# Altium schematic sheet Lesegerät_Lastmodulation_Sekundär.SchDoc
size A4; SheetNumber: 5; SheetTotal: 6
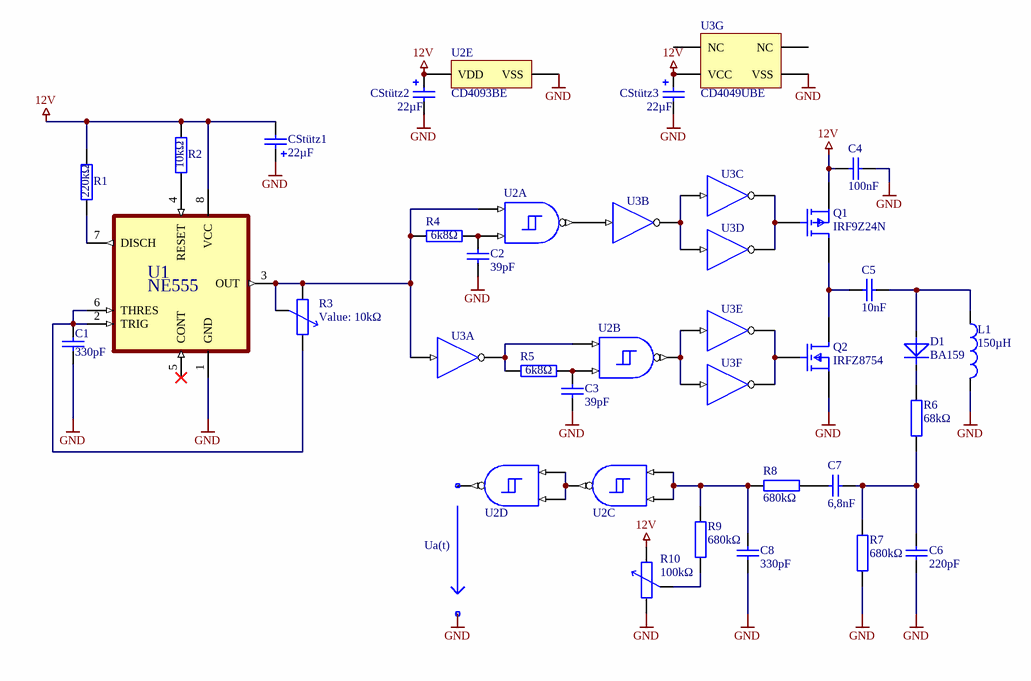
[diagram p0: Lesegerät_Lastmodulation_Sekundär.SchDoc]

## Parts
*  Ua(t)
C1  330pF  [rad-7.2/2.5/5]
C2  value 39pF  [rad-7.2/2.5/5]  (hidden comment: KO)
C3  value 39pF  [rad-7.2/2.5/5]  (hidden comment: KO)
C4  value 100nF  [rad-7.2/2.5/5]  (hidden comment: KO)
C5  value 10nF  [rad-7.2/2.5/5]  (hidden comment: KO)
C6  value 220pF  [rad-7.2/2.5/5]  (hidden comment: KO)
C7  value 6,8nF  [rad-7.2/2.5/5]  (hidden comment: KO)
C8  value 330pF  [rad-7.2/2.5/5]  (hidden comment: KO)
CStütz1  value 22µF  [RB-.1/.2]  (hidden comment: ELKO)
CStütz2  value 22µF  [RB-.1/.2]  (hidden comment: ELKO)
CStütz3  value 22µF  [RB-.1/.2]  (hidden comment: ELKO)
D1  BA159  [DIODE-0.6]
L1  value 150µH  (hidden comment: Inductor)
Q1  IRF9Z24N  [FP-PG-SOT323-3-IPC_A]
Q2  IRFZ8754  [FP-SOT23-IPC_A]
R1  value 220kΩ  [Axial-0.4]  (hidden comment: RES)
R2  value 10kΩ  [Axial-0.4]  (hidden comment: RES)
R3  value 10kΩ  [PT15]  (hidden comment: POT)
R4  value 6k8Ω  [Axial-0.4]  (hidden comment: RES)
R5  value 6k8Ω  [Axial-0.4]  (hidden comment: RES)
R6  value 68kΩ  [Axial-0.4]  (hidden comment: RES)
R7  value 680kΩ  [Axial-0.4]  (hidden comment: RES)
R8  value 680kΩ  [Axial-0.4]  (hidden comment: RES)
R9  value 680kΩ  [Axial-0.4]  (hidden comment: RES)
R10  value 100kΩ  [PT15]  (hidden comment: POT)
U1  NE555  [DIP794W45P254L959H508Q8]
U2  CD4093BE  [N0014A]  (value not drawn)  (parts A,B,C,D,E of 5)
U3  CD4049UBE  [N0016A]  (value not drawn)  (parts A,B,C,D,E,F,G of 7)

## Nets
12V: C4.1 CStütz1.2 CStütz2.1 CStütz3.1 Q1.2(S) R1.2 R2.2 R10.2 U1.8(VCC) U2.14(VDD) U3.1(VCC)
GND: C1.2 C2.2 C3.2 C4.2 C6.2 C8.2 CStütz1.1 CStütz2.2 CStütz3.2 L1.2 Q2.2(S) R7.1 R10.1 U1.1(GND) U2.7(VSS) U3.8(VSS)
NetC1_1: C1.1 R3.2 U1.2(TRIG) U1.6(THRES)
NetC2_1: C2.1 R4.2 U2.2(B)
NetC3_1: C3.1 R5.2 U2.6(D)
NetC5_1: C5.1 Q1.3(D) Q2.3(D)
NetC5_2: C5.2 D1.1(A) L1.1
NetC6_1: C6.1 C7.2 R6.1 R7.2
NetC7_1: C7.1 R8.1
NetC8_1: C8.1 R8.2 R9.1 U2.8(E) U2.9(F)
NetD1_2: D1.2(K) R6.2
NetQ1_G2: Q1.G2(G) U3.6(I=~{C}) U3.10(J=~{D})
NetQ2_G1: Q2.G1(G) U3.12(K=~{E}) U3.15(L=~{F})
NetR1_1: R1.1 U1.7(DISCH)
NetR2_1: R2.1 U1.4(RESET)
NetR3_1: R3.1 R3.3 R4.1 U1.3(OUT) U2.1(A) U3.3(A)
NetR5_1: R5.1 U2.5(C) U3.2(G=~{A})
NetR9_2: R9.2 R10.3
NetU2_3: U2.3(J) U3.5(B)
NetU2_4: U2.4(K) U3.11(E) U3.14(F)
NetU2_10: U2.10(L) U2.12(G) U2.13(H)
NetU3_4: U3.4(H=~{B}) U3.7(C) U3.9(D)

Not connected (* = marked no-connect by the designer): U1 5(CONT)*; U2 11(M); U3 13(NC) 16(NC)

## Notes on the sheet
- Labels drawn without touching a wire or pin: GND

## Library data of the parts
* = Spannungspfeil
C1-C8 = KO: Kondensator
D1 = DIODE
L1 = Inductor: SimulationGenericComponent: True
Q1 = CMP-32901-000121-1: MOSFET P-CH 60V 150MA SOT-323; Manufacturer: Infineon; Manufacturer Part Number: BSS84PWH6327XTSA1; Automotive Grade: Grade 0; Turn On Delay Time: 6.7ns; Input Capacitace At Vds: 15.3pF @ -25V; Continuous Drain Current: -0.15A; Transconductance: 0.16S; Depletion Mode: False; Max Forward Diode Voltage: -1.12V; Number Of P Channels: 1; Reverse Recovery Charge: 11.6nC; Reverse Recovery Time: 23.6ns; Drain To Source Breakdown Voltage: -60V; Typ Forward Diode Voltage: -0.84V; Threshold Vgs Max: -2V; Turn Off Delay Time: 8.6ns; Gate Charge At Vgs: 1nC @ -10V; Power Dissipation: 0.3W; Pulse Drain Current: -0.6A; Max Junction Temp: +150°C; Gate To Source Voltage: 20V; Rthja Max: 420K/W; Drain To Source Resistance: 6.9Ω; Threshold Vgs Min: -1V; Footprint Url: https://www.infineon.com/cms/en/product/packages/PG-SOT323/PG-SOT323-3-2/; ComponentLink2URL: https://www.infineon.com/dgdl/Infineon-BSS84PW-DS-v02_00-EN.pdf?fileId=db3a3043321e49940132482056d32474; Temperature Range Low: -55°C; Temperature: -55°C to +150°C; Octopart: https://octopart.com/bss84pwh6327xtsa1-infineon-22361355; Category: Trans; Height: 1mm; Lead Free: Yes; Ipc Land Pattern Name: SOT65P210X90-3; Automotive: Yes; Number Of Channels: 1; Digikey Description: MOSFET P-CH 60V 150MA SOT-323; ComponentLink2Description: Datasheet; Device Class L2: Transistors; Drain To Source Voltage: -60V; Temperature Range High: +150°C; Device Class L1: Discrete Semiconductors; RoHS: TRUE; Mouser Description: MOSFET P-Ch -60V 150mA SOT-323-3; Device Class L3: MOSFETs; Package: PG-SOT323-3
Q2 = CMP-12801-000064-2: MOSFET N-CH 60V .15MA SOT23-3; On-State Resistance: 5R; Continuous Drain Current (ID): 150mA; Threshold Voltage: 3V; Number of Channels: 1; Gate to Source Voltage (Vgs): 20V; Turn-On Delay Time: 10ns; Power Dissipation: 330mW; Element Configuration: Single; Input Capacitance: 60pF; Weight: 0.000282oz; Height: 1mm; Max Operating Temperature: 150°C; Dual Supply Voltage: 60V; Termination: SMD/SMT; Number of Pins: 3; Number of Elements: 1; Mount: Surface Mount; Min Operating Temperature: -55°C; Nominal Vgs: 3V; Width: 1.4mm; Drain to Source Breakdown Voltage: 60V; Turn-Off Delay Time: 10ns; Case/Package: SOT-23; REACH SVHC: No SVHC; Packaging: Tape and Reel; Length: 3.05mm; Max Power Dissipation: 330mW; Rds On Max: 5R; Lead Free: Lead Free; Contact Plating: Tin; Drain to Source Resistance: 5R; Drain to Source Voltage (Vdss): 60V; Package Quantity: 3000; Current Rating: 150mA; Voltage Rating (DC): 60V
R1 R2 R4-R9 = RES: Widerstand
R3 R10 = POT: Potentiometer; Set Position: 0.5
U1 = NE555P: Single Precision Timer; MF: Texas; SnapEDA_Link: https://www.snapeda.com/parts/NE555P/Texas+Instruments/view-part/?ref=snap; Package: PDIP-8 Texas; Value: *; MP: NE555P; Check_prices: https://www.snapeda.com/parts/NE555P/Texas+Instruments/view-part/?ref=eda
U2 = CMP-1627-00493-3: CMOS Quad 2-Input NAND Schmitt Triggers, N0014A, TUBE; Manufacturer: Texas Instruments; ICC @ Nom Voltage(Max)(mA): 0.06; VCC(Min)(V): 3; Rating: Catalog; Bits(#): 4; Technology Family: CD4000; Output Drive (IOL/IOH)(Max)(mA): 1.5/-1.5; VCC(Max)(V): 18; Voltage(Nom)(V): 10; Schmitt Trigger: Yes; F @ Nom Voltage(Max)(Mhz): 8; DatasheetVersion: SCHS115D; PackageReference: N0014A; Code_JEDEC: MS-001; Output Type: CMOS; Input Type: CMOS; Generic Part Number: CD4093B; Operating Temperature Range(C): -55 to 125
U3 = CMP-1615-00914-2: CMOS Hex Inverting Buffer/Converter, N0016A, TUBE; Manufacturer: Texas Instruments; Rating: Military; Voltage(Nom)(V): 5; VCC(Min)(V): 3; VCC(Max)(V): 18; Output Drive (IOL/IOH)(Max)(mA): -1.2/5.2; ICC @ Nom Voltage(Max)(mA): 0.03; F @ Nom Voltage(Max)(Mhz): 12; tpd @ Nom Voltage(Max)(ns): 120; Technology Family: CD4000; Schmitt Trigger: No; Bits(#): 6; Code_JEDEC: MS-001; DatasheetVersion: SCHS046I; Generic Part Number: CD4049UB; Input Type: CMOS; Output Type: CMOS; PackageReference: N0016A; Operating Temperature Range(C): -55 to 125